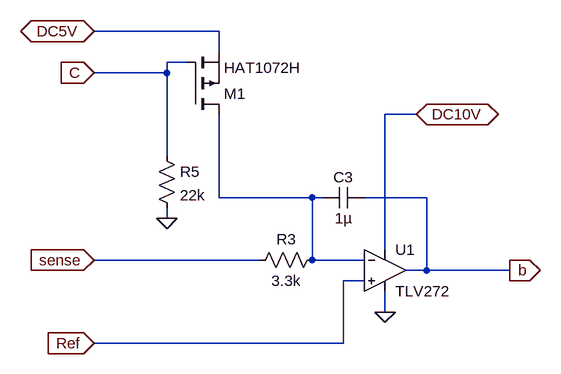
[diagram p0: schematic Feedback.asc]
Feedback.asc, the LTspice schematic file:
Version 4
SHEET 1 880 680
WIRE 0 -256 -192 -256
WIRE 0 -224 0 -256
WIRE -48 -208 -80 -208
WIRE -80 -192 -80 -208
WIRE -80 -192 -192 -192
WIRE 304 -128 256 -128
WIRE -80 -64 -80 -192
WIRE 0 0 0 -128
WIRE 144 0 0 0
WIRE 160 0 144 0
WIRE 320 0 224 0
WIRE -80 32 -80 16
WIRE 256 80 256 -128
WIRE 64 96 -192 96
WIRE 144 96 144 0
WIRE 224 96 144 96
WIRE 320 112 320 0
WIRE 320 112 288 112
WIRE 448 112 320 112
WIRE 224 128 192 128
WIRE 256 176 256 144
WIRE 192 224 192 128
WIRE 192 224 -192 224
FLAG -192 224 Ref
IOPIN -192 224 In
FLAG -192 96 sense
IOPIN -192 96 In
FLAG -192 -256 DC5V
IOPIN -192 -256 BiDir
FLAG -192 -192 C
IOPIN -192 -192 In
FLAG 448 112 b
IOPIN 448 112 Out
FLAG 304 -128 DC10V
IOPIN 304 -128 BiDir
FLAG 256 176 0
FLAG -80 32 0
SYMBOL TLV272 256 112 R0
SYMATTR InstName U1
SYMBOL res 160 80 R90
WINDOW 0 0 56 VBottom 2
WINDOW 3 32 56 VTop 2
SYMATTR InstName R3
SYMATTR Value 3.3k
SYMBOL res -96 -80 R0
SYMATTR InstName R5
SYMATTR Value 22k
SYMBOL pmos -48 -128 M180
SYMATTR InstName M1
SYMATTR Value HAT1072H
SYMBOL cap 224 -16 R90
WINDOW 0 0 32 VBottom 2
WINDOW 3 32 32 VTop 2
SYMATTR InstName C3
SYMATTR Value 1µ

The netlist it stands for:
* Feedback.asc
* U1: TLV272 (symbol TLV272 not available, pins judged from their places): In+=Ref In-=N001 V+=DC10V V-=0 OUT=b
R3 N001 sense 3.3k
R5 C 0 22k
M1 N001 C DC5V DC5V HAT1072H
C3 b N001 1µ
.model NMOS NMOS
.model PMOS PMOS
.lib standard.mos
.backanno
.end